# Altium project AUTOMATIC_WATER_PUMPS_V1.PrjPcb
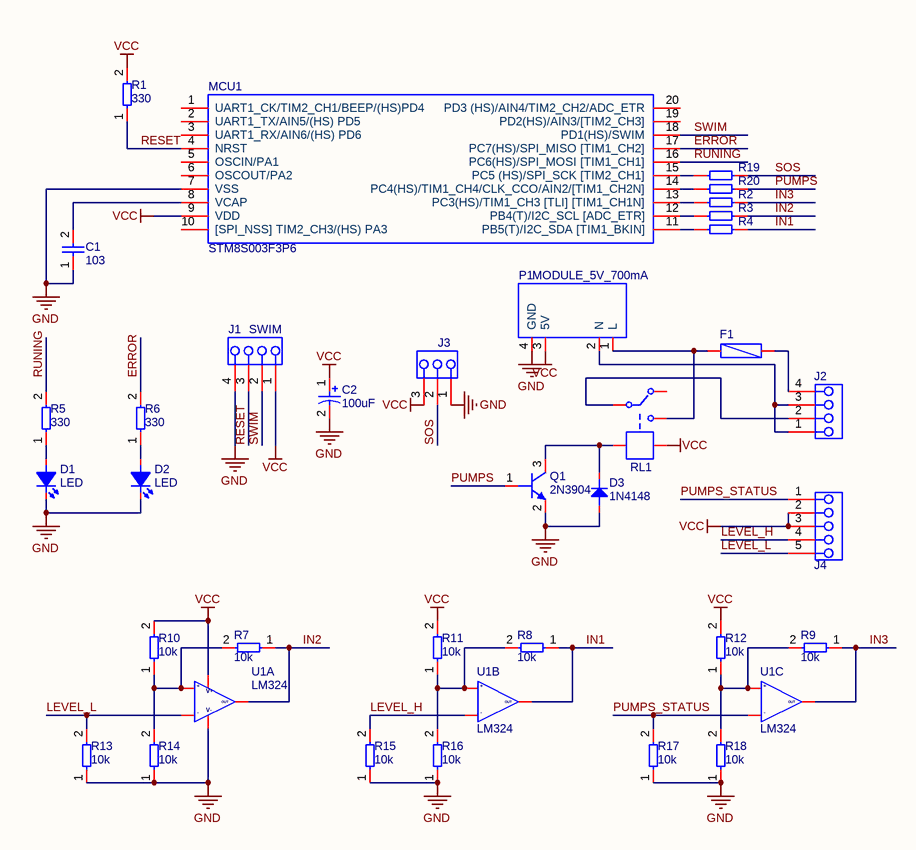
[diagram p0: AUTOMATIC_WATER_PUMPS_V1.SchDoc]
1 sheet, 35 parts. Net scope: global (net labels, ports and power ports of the same name join across sheets).
Board file: AUTOMATIC_WATER_PUMPS_V1.PcbDoc

## Sheet AUTOMATIC_WATER_PUMPS_V1.SchDoc
size A4; ApprovedBy: PHAM VAN LAP; CheckedBy: PHAM VAN LAP; Author: PHAM VAN LAP; CompanyName: C&G Co,LTD; DrawnBy: PHAM VAN LAP; DocumentNumber: SCH; Revision: REV-A1; SheetNumber: 1; SheetTotal: 1

### Parts
C1  103  [C0805]
C2  100uF  [CAP_RAD_3.5mm]
D1  LED  [LED_3MM_GREEN]
D2  LED  [LED_3MM_GREEN]
D3  1N4148  [SOD-80]
F1  Fuse 5x20mm  [FUSE_5x20MM]  (value not drawn)
J1  SWIM  [HEADER-MALE-04PINS-2.54MM]
J2  DEGSON Screws  [DG127-5.0-04P-14-00AH]  (value not drawn)
J3  SOS  [HEADER-MALE-03PINS-2.54MM]  (value not drawn)
J4  DEGSON Screws  [DG127-5.0-05P-14-00AH]  (value not drawn)
MCU1  STM8S003F3P6  [TSSOP20_0.65_4.4]
P1  MODULE_5V_700mA  [MODULE_5V_700mA]
Q1  2N3904  [SOT23-3]
R1  330  [R0805]
R2  10k  [R0805]  (value not drawn)
R3  10k  [R0805]  (value not drawn)
R4  10k  [R0805]  (value not drawn)
R5  330  [R0805]
R6  330  [R0805]
R7  10k  [R0805]
R8  10k  [R0805]
R9  10k  [R0805]
R10  10k  [R0805]
R11  10k  [R0805]
R12  10k  [R0805]
R13  10k  [R0805]
R14  10k  [R0805]
R15  10k  [R0805]
R16  10k  [R0805]
R17  10k  [R0805]
R18  10k  [R0805]
R19  10k  [R0805]  (value not drawn)
R20  10k  [R0805]  (value not drawn)
RL1  RELAY-SONGLE-SRD-05VDC  [RELAY-SONGLE-SRD-05VDC_BLUE]  (value not drawn)
U1  LM324  [SOP-14]  (parts A,B,C of 4)

### Nets
GND: C1.1 C2.2 D1.2(K) D2.2(K) D3.1 J1.4 J3.1 MCU1.7(VSS) P1.4(GND) Q1.2(E) R13.1 R14.1 R15.1 R16.1 R17.1 R18.1 U1.11
VCC: C2.1 J1.1 J3.3 J4.2 J4.3 MCU1.9(VDD) P1.3(5V) R1.2 R10.2 R11.2 R12.2 RL1.3 U1.4
ERROR: MCU1.17(PC7(HS)/SPI_MISO_[TIM1_CH2]) R6.2
IN1: R4.2 R8.1 U1.7(OUT)
IN2: R3.2 R7.1 U1.1(OUT)
IN3: R2.2 R9.1 U1.8(OUT)
LEVEL_H: J4.4 R15.2 U1.6(-)
LEVEL_L: J4.5 R13.2 U1.2(-)
PUMPS: Q1.1(B) R20.2
PUMPS_STATUS: J4.1 R17.2 U1.9(-)
RESET: J1.3 MCU1.4(NRST) R1.1
RUNING: MCU1.16(PC6(HS)/SPI_MOSI_[TIM1_CH1]) R5.2
SOS: J3.2 R19.2
SWIM: J1.2 MCU1.18(PD1(HS)/SWIM)
NetC1_2: C1.2 MCU1.8(VCAP)
NetD1_1: D1.1(A) R5.1
NetD2_1: D2.1(A) R6.1
NetD3_2: D3.2 Q1.3(C) RL1.1
NetF1_1: F1.1 P1.1(L) RL1.4
NetF1_2: F1.2 J2.4
NetJ2_1: J2.1 J2.3 P1.2(N)
NetJ2_2: J2.2 RL1.2
NetMCU1_11: MCU1.11(PB5(T)/I2C_SDA_[TIM1_BKIN]) R4.1
NetMCU1_12: MCU1.12(PB4(T)/I2C_SCL_[ADC_ETR]) R3.1
NetMCU1_13: MCU1.13(PC3(HS)/TIM1_CH3_[TLI]_[TIM1_CH1N]) R2.1
NetMCU1_14: MCU1.14(PC4(HS)/TIM1_CH4/CLK_CCO/AIN2/[TIM1_CH2N]) R20.1
NetMCU1_15: MCU1.15(PC5_(HS)/SPI_SCK_[TIM2_CH1]) R19.1
NetR7_2: R7.2 R10.1 R14.2 U1.3(+)
NetR8_2: R8.2 R11.1 R16.2 U1.5
NetR9_2: R9.2 R12.1 R18.2 U1.10(+)

Not connected (* = marked no-connect by the designer): MCU1 1(UART1_CK/TIM2_CH1/BEEP/(HS)PD4) 2(UART1_TX/AIN5/(HS)_PD5) 3(UART1_RX/AIN6/(HS)_PD6) 5(OSCIN/PA1) 6(OSCOUT/PA2) 10([SPI_NSS]_TIM2_CH3/(HS)_PA3) 19(PD2(HS)/AIN3/[TIM2_CH3]) 20(PD3_(HS)/AIN4/TIM2_CH2/ADC_ETR); RL1 5

### Notes on the sheet
- (in symbol LM324, part A) V+; V-

### Library data of the parts
C1 = C0805
C2 = Capacitor(Radian)
D1 D2 = LED 3MM
D3 = Diode-1N4148
F1 = Fuse-5x20mm
J1 = HEADER-MALE-04PINS-2.54MM
J2 = DG127-5.0-04P-14-00AH
J3 = HEADER-MALE-03PINS-2.54MM
J4 = DG127-5.0-05P-14-00AH
P1 = SMPS_5V_700mA
R1 R5-R18 = Resistor SMD
R2-R4 R19 R20 = Resistors-SMD
U1 = LM324: Quad-Operational Amp